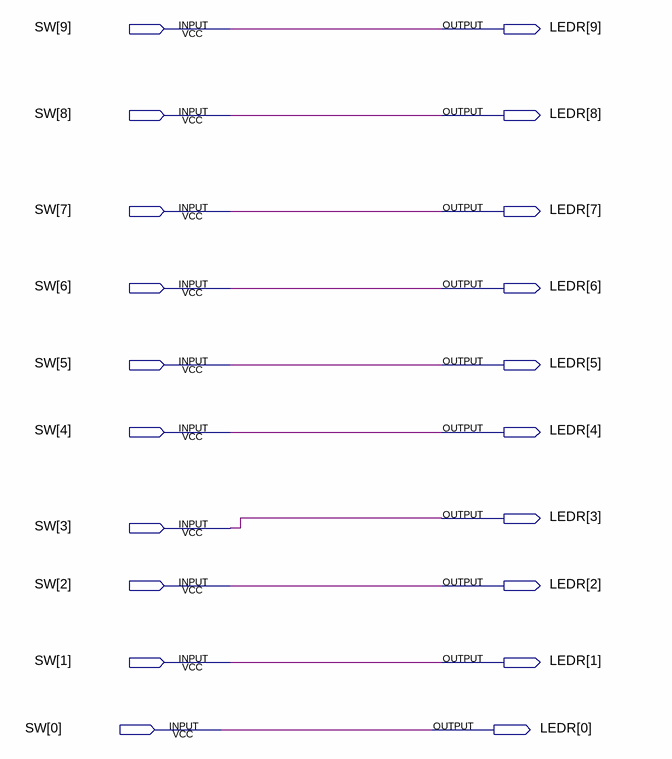
[diagram p0: schematic sheet]
// Quartus schematic Part1.bdf as structural Verilog: 0 symbols, 20 pins
module Part1 (
  input  [9:0] SW,
  output [9:0] LEDR
);


  assign LEDR = SW;
endmodule
